# EAGLE design TSOC_WaterSensor (EAGLE 6.6.0)
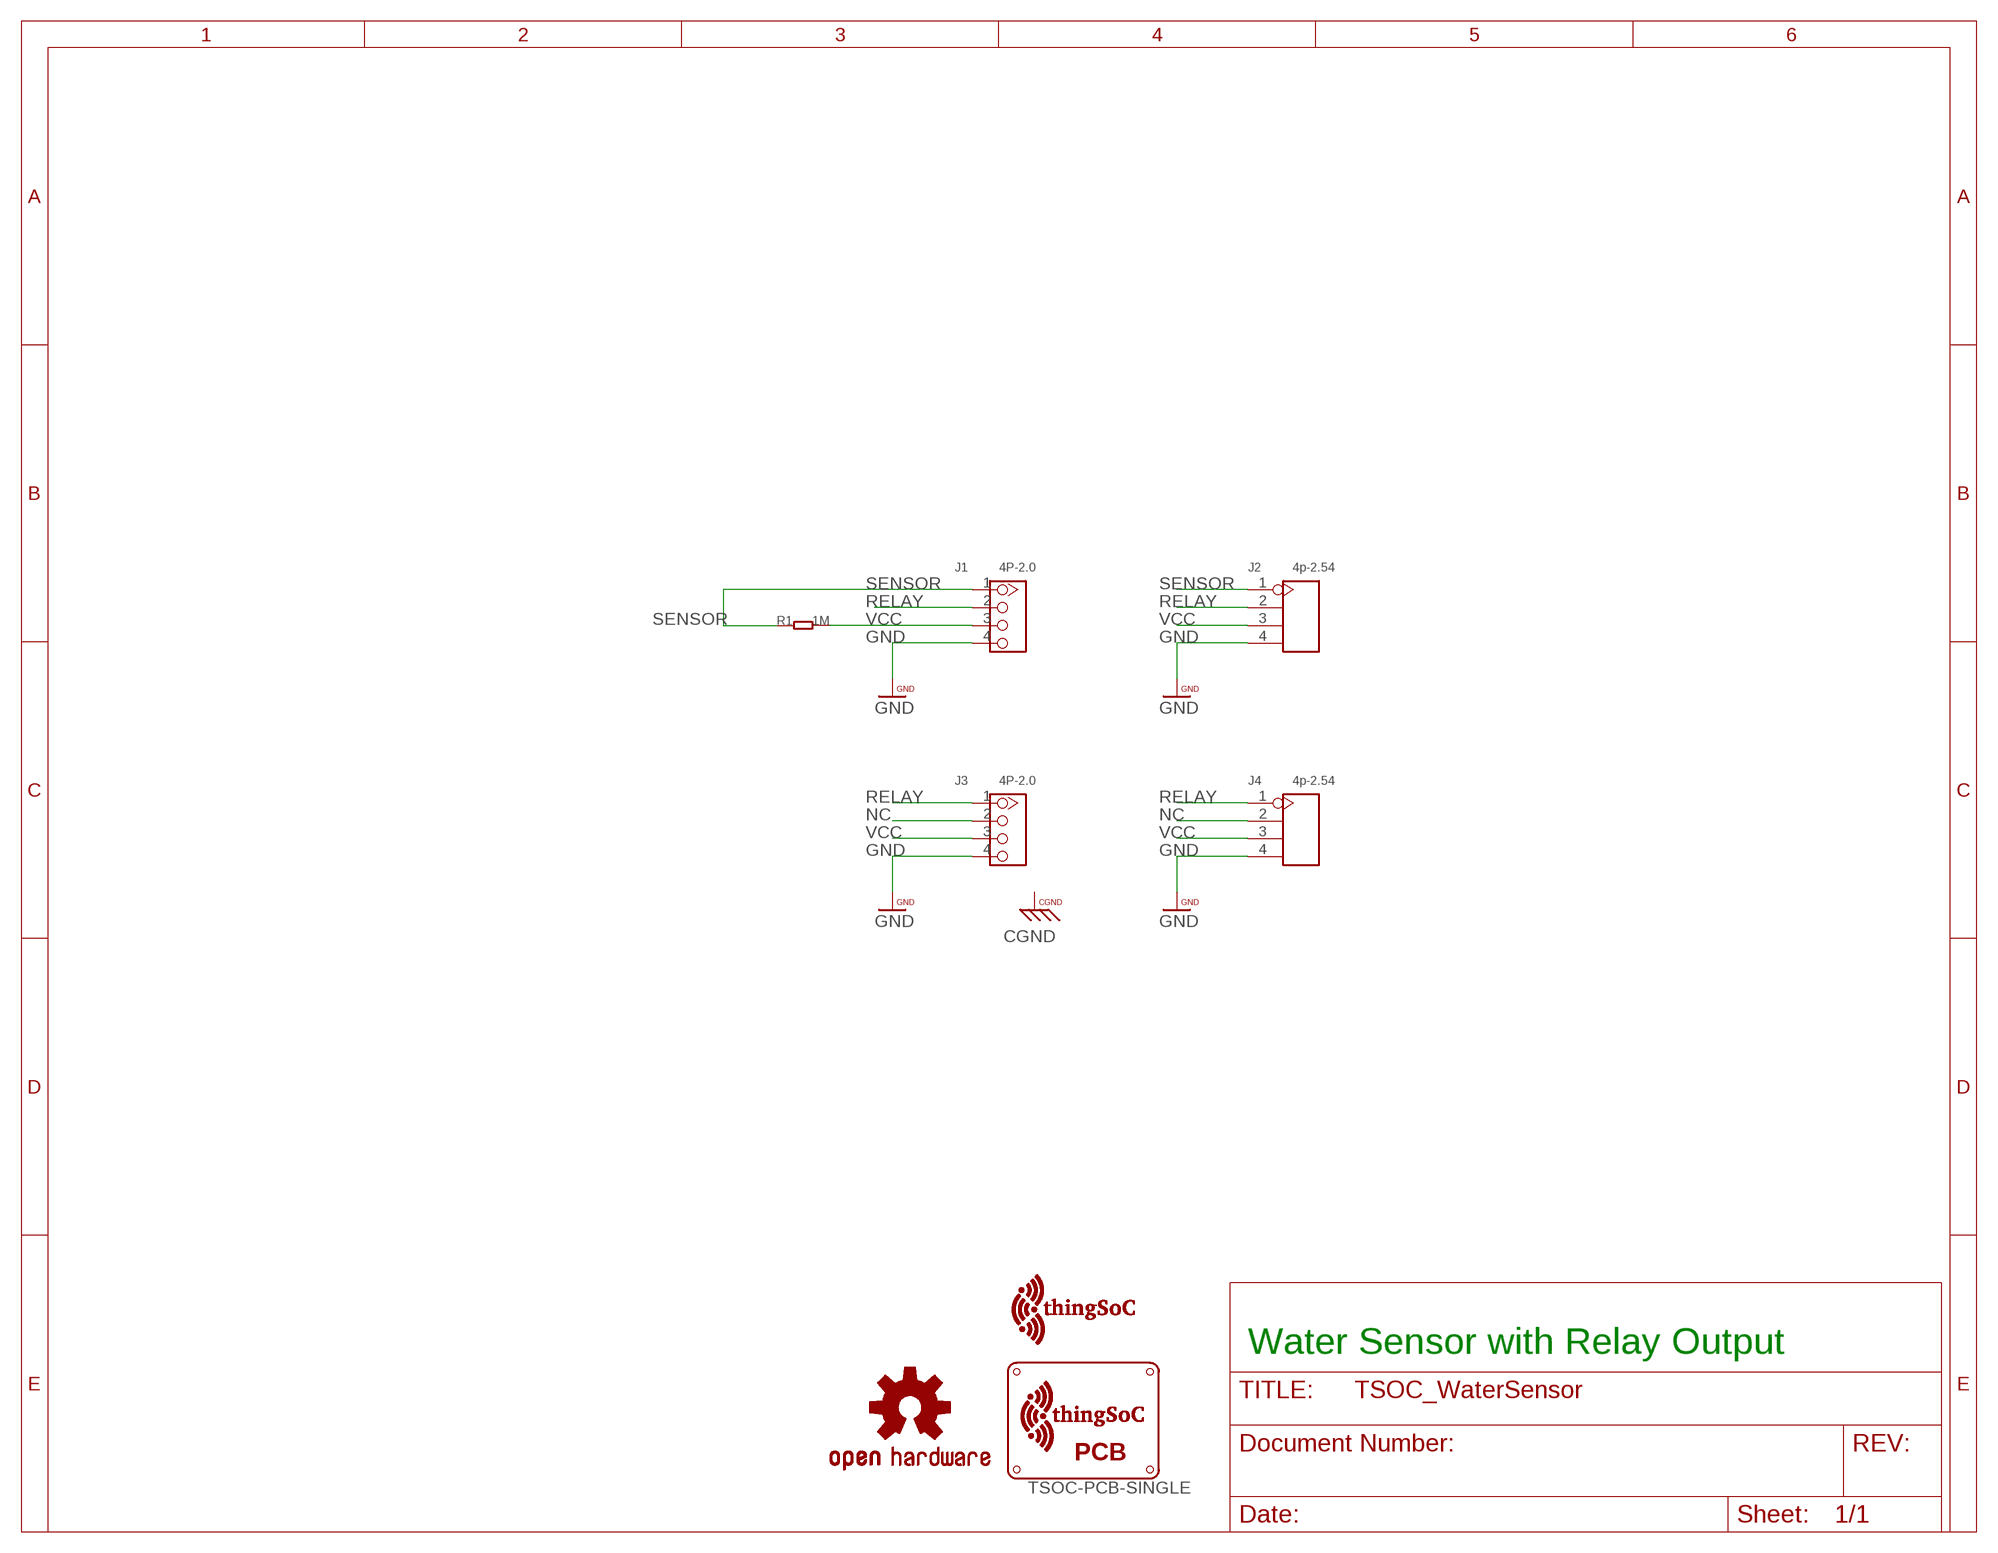
[diagram p0: schematic, sheet 1]

## Parts
J1  4P-2.0  GROVE-CONNECTOR-DIP(4P-2.0)  [HW4-2.0]
J2  4p-2.54  DIP-BLACK-MALE-HEADER-VERT(4P-2.54)  [H4-2.54]
J3  4P-2.0  GROVE-CONNECTOR-DIP(4P-2.0)  [HW4-2.0]
J4  4p-2.54  DIP-BLACK-MALE-HEADER-VERT(4P-2.54)  [H4-2.54]
R1  1M  R0603  [0603]
U$1  OSHW_LOGO_SYMM  [OSHW_LOGO_MED_SYM]
U$2  TSOC-LOGO-LRG  [TSOC-LOGO-LRG]
U$3  TSOC-PCB-SINGLE  [TSOC-BB-BRD-DIM]

## Nets
GND: J1.4 J2.4 J3.4 J4.4
NC: J3.2 J4.2
RELAY: J1.2 J2.2 J3.1 J4.1
SENSOR: J1.1 J2.1 R1.1
VCC: J1.3 J2.3 J3.3 J4.3 R1.2

## Notes on the sheet
- Water Sensor with Relay Output

## Library data of the parts
J1 J3 = Seeed-Connector -2016:GROVE-CONNECTOR-DIP(4P-2.0): 320110033
J2 J4 = Seeed-Connector -2016:DIP-BLACK-MALE-HEADER-VERT(4P-2.54): 320020017; MPN: P125-1104A0BS116A1
R1 = CPT_SMD:R0603
U$1 = PatternAgents-Logos:OSHW_LOGO_SYM: OSHW_LOGO_SYM Source : http://freedomdefined.org/OSHW#Logo_repository Github : https://github.com/PatternAgents/PCB_Libraries License : http://creativecommons.org/licenses/by-sa/3.0/ (Creative Commons 3.0) THIS SOFTWARE IS PROVIDED BY THE CONTRIBUTORS "AS IS" AND WITHOUT ANY EXPRESS OR IMPLIED WARRANTIES, INCLUDING, BUT NOT LIMITED TO, THE IMPLIED WARRANTIES OF MERCHANTABILITY AND FITNESS FOR A PARTICULAR PURPOSE ARE DISCLAIMED. IN NO EVENT SHALL THE COPYRIGHT OWNER OR CONTRIBUTORS BE LIABLE FOR ANY DIRECT, INDIRECT, INCIDENTAL, SPECIAL, EXEMPLARY, OR CONSEQUENTIAL DAMAGES (INCLUDING, BUT NOT LIMITED TO, PROCUREMENT OF SUBSTITUTE GOODS OR SERVICES; LOSS OF USE, DATA, OR PROFITS; OR BUSINESS INTERRUPTION) HOWEVER CAUSED AND ON ANY THEORY OF LIABILITY, WHETHER IN CONTRACT, STRICT LIABILITY, OR TORT (INCLUDING NEGLIGENCE OR OTHERWISE) ARISING IN ANY WAY OUT OF THE USE OF THIS SOFTWARE, EVEN IF ADVISED OF THE POSSIBILITY OF SUCH DAMAGE.
U$2 = thingSoC:TSOC-LOGO: thingSoC Logo Source LBR : http://www.thingsoc.com Github : https://github.com/thingsoc License : http://creativecommons.org/licenses/by-sa/4.0/ (Creative Commons 4.0) THIS SOFTWARE IS PROVIDED BY THE CONTRIBUTORS "AS IS" AND WITHOUT ANY EXPRESS OR IMPLIED WARRANTIES, INCLUDING, BUT NOT LIMITED TO, THE IMPLIED WARRANTIES OF MERCHANTABILITY AND FITNESS FOR A PARTICULAR PURPOSE ARE DISCLAIMED. IN NO EVENT SHALL THE COPYRIGHT OWNER OR CONTRIBUTORS BE LIABLE FOR ANY DIRECT, INDIRECT, INCIDENTAL, SPECIAL, EXEMPLARY, OR CONSEQUENTIAL DAMAGES (INCLUDING, BUT NOT LIMITED TO, PROCUREMENT OF SUBSTITUTE GOODS OR SERVICES; LOSS OF USE, DATA, OR PROFITS; OR BUSINESS INTERRUPTION) HOWEVER CAUSED AND ON ANY THEORY OF LIABILITY, WHETHER IN CONTRACT, STRICT LIABILITY, OR TORT (INCLUDING NEGLIGENCE OR OTHERWISE) ARISING IN ANY WAY OUT OF THE USE OF THIS SOFTWARE, EVEN IF ADVISED OF THE POSSIBILITY OF SUCH DAMAGE.
U$3 = thingSoC:TSOC-PCB: thingSoC PCB Outlines Boards Outlines for Standard Sizes (in the DImension Layer) (Registration marks in the tDocu layer - make sure to turn on tDocu/bDocu) Source LBR : http://www.thingsoc.com Github : https://github.com/thingsoc License : http://creativecommons.org/licenses/by-sa/4.0/ (Creative Commons 4.0) THIS SOFTWARE IS PROVIDED BY THE CONTRIBUTORS "AS IS" AND WITHOUT ANY EXPRESS OR IMPLIED WARRANTIES, INCLUDING, BUT NOT LIMITED TO, THE IMPLIED WARRANTIES OF MERCHANTABILITY AND FITNESS FOR A PARTICULAR PURPOSE ARE DISCLAIMED. IN NO EVENT SHALL THE COPYRIGHT OWNER OR CONTRIBUTORS BE LIABLE FOR ANY DIRECT, INDIRECT, INCIDENTAL, SPECIAL, EXEMPLARY, OR CONSEQUENTIAL DAMAGES (INCLUDING, BUT NOT LIMITED TO, PROCUREMENT OF SUBSTITUTE GOODS OR SERVICES; LOSS OF USE, DATA, OR PROFITS; OR BUSINESS INTERRUPTION) HOWEVER CAUSED AND ON ANY THEORY OF LIABILITY, WHETHER IN CONTRACT, STRICT LIABILITY, OR TORT (INCLUDING NEGLIGENCE OR OTHERWISE) ARISING IN ANY WAY OUT OF THE USE OF THIS SOFTWARE, EVEN IF ADVISED OF THE POSSIBILITY OF SUCH DAMAGE.

## Board
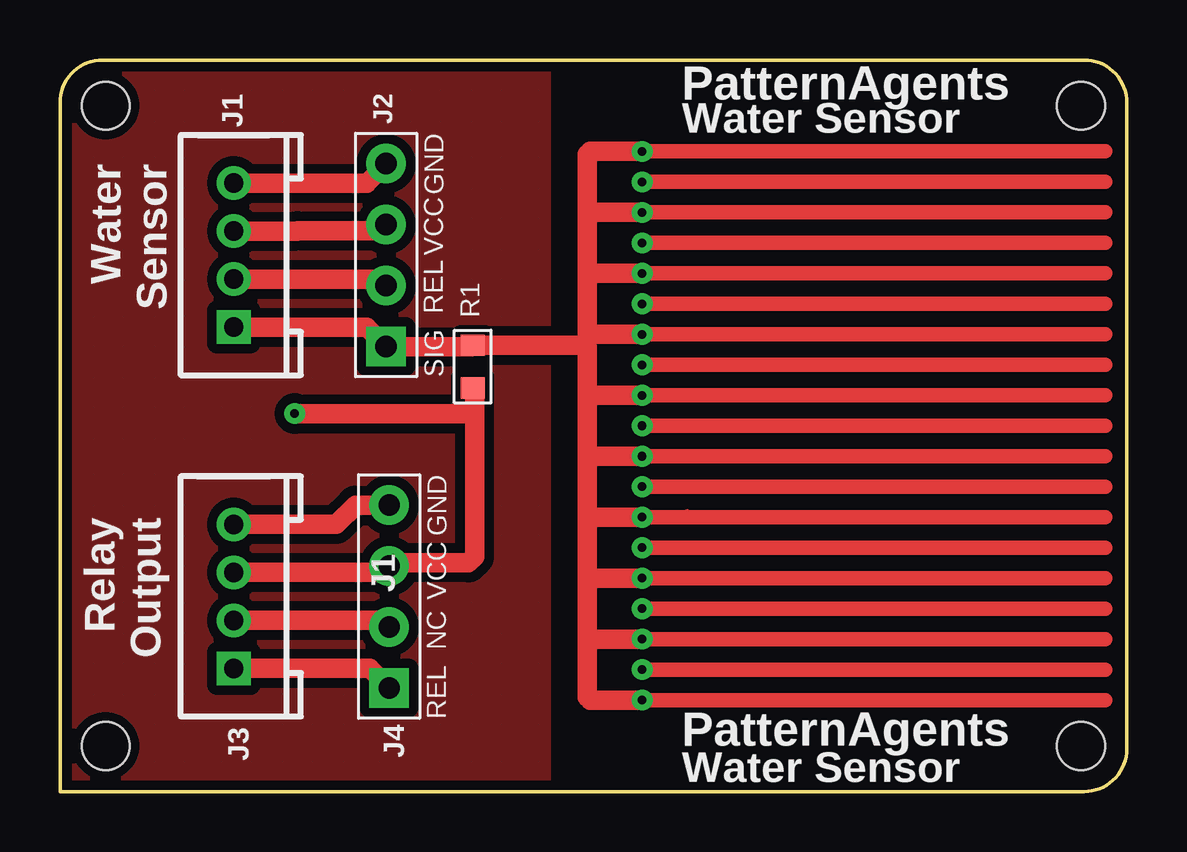
[diagram p1: board, top side]
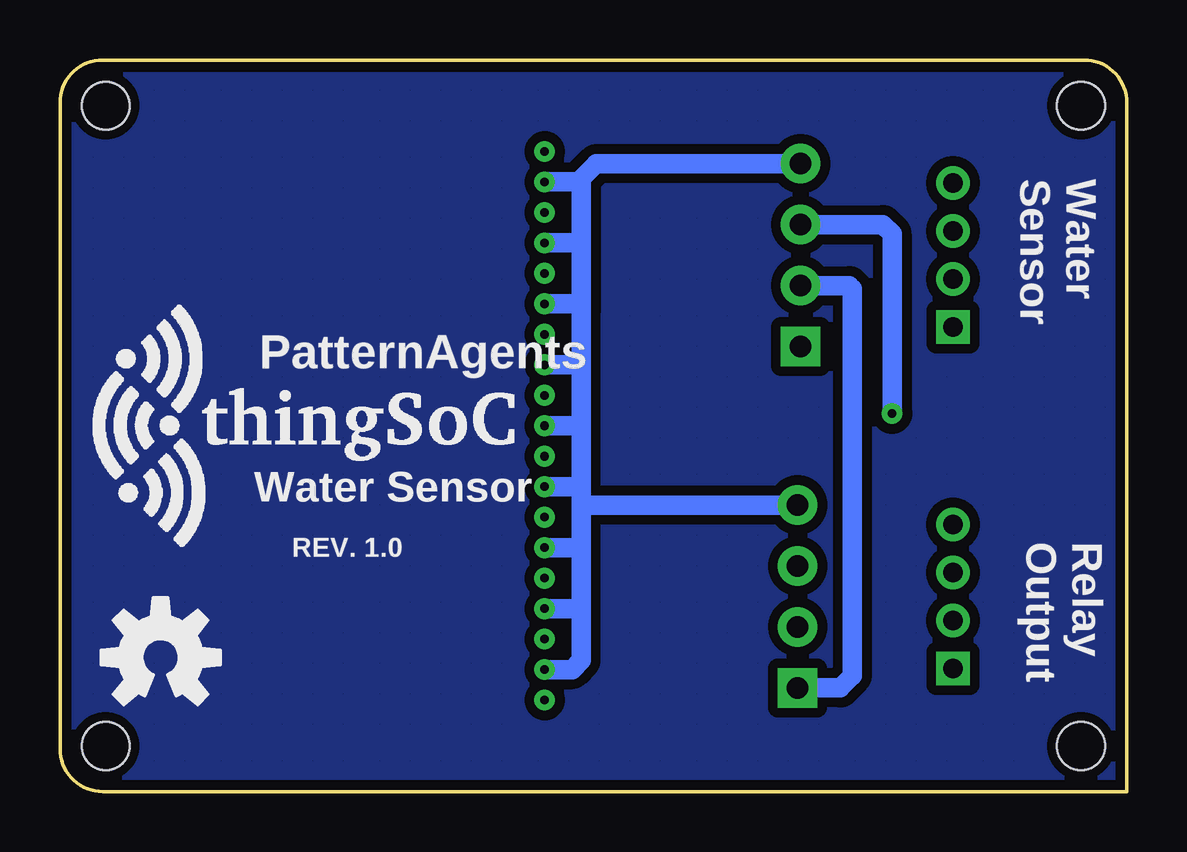
[diagram p2: board, bottom side, seen from below]

Size 44.45 x 30.48 mm. Coordinates in mm from the lower left corner, seen from the top.
Copper layers (1*16): Top 0.035mm / dielectric 1.5mm / Bottom 0.035mm
Design rules "PatternAgents_7mil": minimum track width 7mil, minimum drill 14mil, track to track 7mil, track to pad 7mil, pad to pad 7mil, via to via 7mil, smd to smd 7mil, copper to edge 7mil, drill to drill 7mil, minimum pad ring 12mil, minimum via ring 10mil, stop-mask expansion 4mil, vias tented up to drill 25mil, thermal gap 7mil

### Footprints (pad centres in the part's own frame; a part is rotated, then mirrored left to right if it is on the bottom)
HW4-2.0 = drill 0.8 pad 1.27 square: 1 -3,0 | drill 0.8 pad 1.27: 2 -1,0; 3 1,0; 4 3,0
H4-2.54 = drill 0.889 pad 1.651 square: 1 0,3.81 | drill 0.889 pad 1.651: 2 0,1.27; 3 0,-1.27; 4 0,-3.81
0603 = smd 0.889 x 1.016: 1 -0.889,0; 2 0.889,0
TSOC-BB-BRD-DIM = hole 2: 13.335,16.891; -13.335,16.891; 13.335,-23.749; -13.335,-23.749

### Placement (x,y rotation side)
J1  7.24,22.35 90 top
J2  13.59,22.35 180 top
J3  7.24,8.13 90 top
J4  13.72,8.13 180 top
R1  17.2,17.7 270 top
U$1  40.26,5.59 0 bottom
U$2  39.88,15.24 0 bottom
U$3  25.65,15.24 270 top

### Tracks (layer width: path | path; a pad name or v marks a point on that pad's centre or on a via)
CGND
  pour Bottom (isolate 0.406, hatched): 0,0 0,28.58 arc-90 2.03,30.48 42.38,30.48 arc-90 44.45,28.54 44.45,1.89 arc-90 42.56,0
  pour Top (isolate 0.406, hatched): 0,0 0,28.54 arc-90 2.07,30.48 20.32,30.48 20.32,0
GND  (via drill 0.36)
  Top 0.178: 25.43,5.28 25.43,5.08
  Top 0.61: v24.26,10.16 43.56,10.16 | 43.56,17.78 v24.26,17.78 | v24.26,15.24 43.56,15.24 | v24.26,12.7 43.56,12.7 | v24.26,20.32 43.56,20.32 | 43.56,22.86 v24.26,22.86 | v24.26,25.4 43.56,25.4 | v24.26,5.08 25.43,5.08 43.56,5.08 | v24.26,7.62 43.56,7.62
  Top 0.813: J3.4 11.51,11.13 12.32,11.94 J4.4 | J1.4 12.78,25.35 J2.4
  Bottom 0.178: 22.73,9.91 22.76,9.91 22.99,10.16
  Bottom 0.61: 22.86,17.78 22.73,17.65 | 23.11,20.32 22.73,19.94 | 22.86,25.4 22.73,25.27 | 22.61,11.94 22.73,11.81
  Bottom 0.813: v24.26,10.16 22.99,10.16 22.73,10.41 22.73,11.81 22.73,12.45 | 22.73,12.45 22.73,15.24 | 22.73,15.24 22.73,17.65 22.73,19.94 22.73,22.86 | v24.26,12.7 22.99,12.7 22.73,12.45 | v24.26,15.24 22.73,15.24 | v24.26,17.78 22.86,17.78 | v24.26,20.32 23.11,20.32 | v24.26,25.4 22.86,25.4 22.1,26.16 J2.4 | 22.73,25.27 22.73,22.86 | v24.26,22.86 22.73,22.86 | v24.26,5.08 23.11,5.08 22.73,5.46 22.73,7.62 | 22.73,7.62 22.73,9.91 22.73,10.67 | v24.26,7.62 22.73,7.62 | J4.4 22.61,11.94
NC
  Top 0.813: J3.2 13.45,7.13 J4.2
RELAY
  Top 0.813: J3.1 12.91,5.13 J4.1 | J1.2 13.32,21.35 J2.2
  Bottom 0.813: J2.2 11.56,21.08 11.43,20.95 11.43,4.83 11.94,4.32 J4.1
SENSOR  (via drill 0.36)
  Top 0.178: 22.23,11.43 22.23,11.51 21.97,11.51 | 21.97,6.71 22.05,6.71 21.97,6.35 | 26.14,11.68 26.14,11.43 | 21.97,21.82 22.05,21.82 21.97,21.59
  Top 0.61: v24.26,16.51 43.56,16.51 | 43.56,19.05 v24.26,19.05 | v24.26,13.97 43.56,13.97 | v24.26,8.89 43.56,8.89 | v24.26,21.59 43.56,21.59 | v24.26,11.43 26.14,11.43 43.56,11.43 | 22.23,13.97 21.97,13.72 | 22.1,16.51 21.97,16.38 | 21.97,18.54 21.97,19.05 | 22.1,8.89 21.97,9.02 | 43.56,24.13 v24.26,24.13 | v24.26,26.67 43.56,26.67 | 22.1,26.67 21.97,26.54 | v24.26,3.81 43.56,3.81 | v24.26,6.35 43.56,6.35 | 21.97,3.94 22.1,3.81
  Top 0.813: v24.26,11.43 22.23,11.43 22.1,11.43 | v24.26,13.97 22.23,13.97 | v24.26,16.51 22.1,16.51 | 21.97,21.59 21.97,19.05 v24.26,19.05 | 21.97,6.35 21.97,6.71 21.97,9.02 21.97,11.51 21.97,13.72 21.97,16.38 21.97,18.54 21.92,18.59 R1.1 17.14,18.54 J2.1 12.78,19.35 J1.1 | v24.26,8.89 22.1,8.89 | v24.26,21.59 21.97,21.59 | v24.26,26.67 22.1,26.67 | 21.97,26.54 21.97,24.13 | 21.97,24.13 21.97,21.82 21.97,21.59 | v24.26,24.13 21.97,24.13 | v24.26,6.35 21.97,6.35 | 21.97,6.35 21.97,3.94 | 22.1,3.81 v24.26,3.81
VCC  (via drill 0.36)
  Top 0.813: J3.3 13.45,9.13 J4.3 13.84,9.53 17.02,9.53 17.27,9.78 17.27,15.88 | J1.3 9.89,23.35 9.91,23.37 13.34,23.37 J2.3 | 17.27,15.88 17.27,16.74 R1.2 | v9.78,15.75 17.14,15.75 17.27,15.88
  Bottom 0.813: J2.3 10.16,23.62 9.78,23.24 v9.78,15.75

### Text on the board
tPlace: PatternAgents | GND | Water Sensor | Water / Sensor | VCC | REL | SIG | GND | Relay / Output | J1 | VCC | NC | REL | PatternAgents | Water Sensor
bPlace: Water / Sensor | PatternAgents | Water Sensor | Relay / Output | REV. 1.0